# Altium schematic sheet DAC.SchDoc
size 193 x 146 mm; DocumentNumber: 1; SheetNumber: 1; SheetTotal: 11
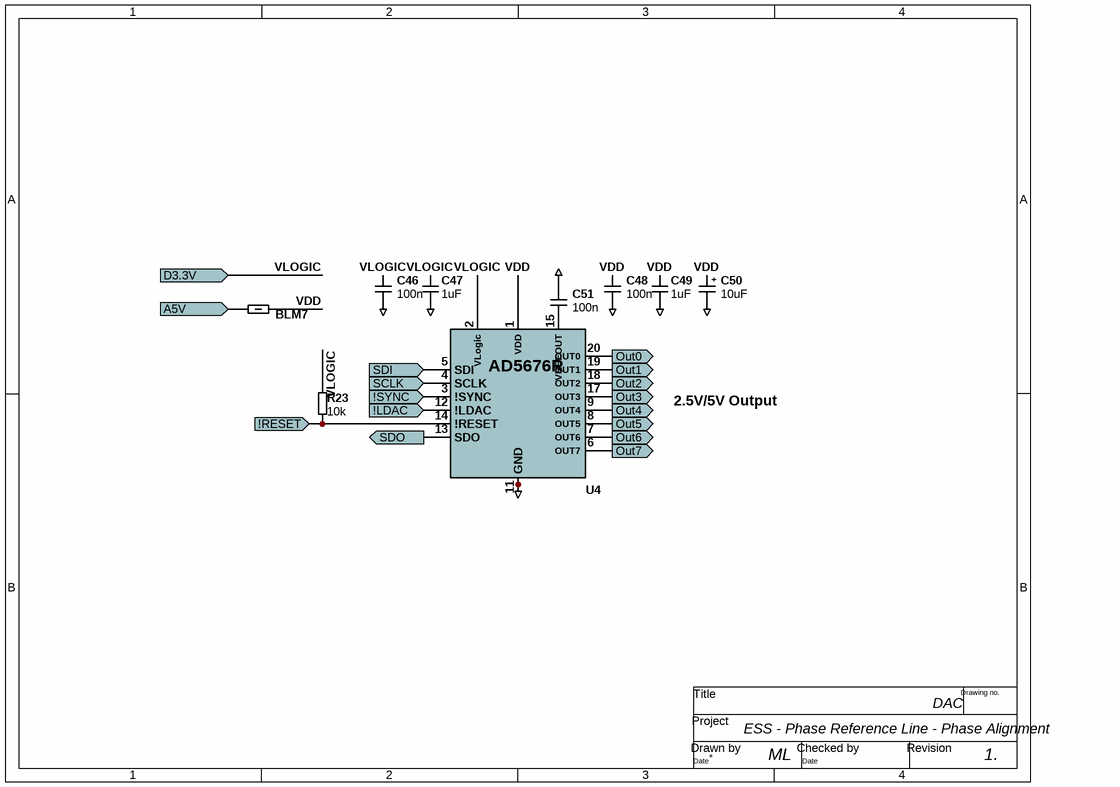
[diagram p0: DAC.SchDoc]

## Parts
BLM7  120 Ohms @ 100MHz  [0402-Inductor]  (value not drawn)
C46  100n  [0402-Capacitor]  (net tie, no BOM)
C47  1uF  [0805-Capacitor]
C48  100n  [0402-Capacitor]  (net tie, no BOM)
C49  1uF  [0805-Capacitor]
C50  10uF  [1206-cap_tant]
C51  100n  [0402-Capacitor]  (net tie, no BOM)
R23  10k  [0402-RESISTOR]
U4  AD5676R  [LFCSP-20]  (value not drawn)

## Ports
!LDAC (in), !RESET (in), !SYNC (in), A5V (in), D3.3V (in), Out0 (out), Out1 (out), Out2 (out), Out3 (out), Out4 (out), Out5 (out), Out6 (out), Out7 (out), SCLK (in), SDI (in), SDO (out)

## Nets
GND: C46.1 C47.2 C48.1 C49.2 C50.2(-) C51.2 U4.11(GND) U4.EP
!LDAC: U4.12(!LDAC) ; port !LDAC
!RESET: R23.2 U4.14(!RESET) ; port !RESET
!SYNC: U4.3(!SYNC) ; port !SYNC
A5V: BLM7.1 ; port A5V
Out0: U4.20(OUT0) ; port Out0
Out1: U4.19(OUT1) ; port Out1
Out2: U4.18(OUT2) ; port Out2
Out3: U4.17(OUT3) ; port Out3
Out4: U4.9(OUT4) ; port Out4
Out5: U4.8(OUT5) ; port Out5
Out6: U4.7(OUT6) ; port Out6
Out7: U4.6(OUT7) ; port Out7
SCLK: U4.4(SCLK) ; port SCLK
SDI: U4.5(SDI) ; port SDI
SDO: U4.13(SDO) ; port SDO
VDD: BLM7.2 C48.2 C49.1 C50.1(+) U4.1(VDD)
VLOGIC: C46.2 C47.1 R23.1 U4.2(VLogic) ; port D3.3V
NetC51_1: C51.1 U4.15(VREFOUT)

Not connected (* = marked no-connect by the designer): U4 10(NC) 16(NC)

## Notes on the sheet
- 2.5V/5V Output
- ESS - Phase Reference Line - Phase Alignment
- DAC
- ML
- 1.
- Title
- Project
- Drawing no.
- Date
- Drawn by
- Checked by
- Revision

## Library data of the parts
BLM7 = BLM15AX121SZ1D: 120 Ohms @ 100MHz 1 Power, Signal Line Ferrite Bead 0402 (1005 Metric) 700mA 130mOhm; Case: 0402; Supplier 1: Digi-Key; Supplier Part Number 1: 490-16510-1-ND; HelpURL: https://www.murata.com/en-us/products/productdata/8796748677150/QNFA9118.pdf
C46 C48 = C_0402: Capacitor 0402; Dielectric: X7R/C0G; Tolerance: ±20%; Voltage Rating: 16V; Value: 100n; Case: 0402
C47 C49 = C_0805: Capacitor 0805; Dielectric: X7R/C0G; Tolerance: ±20%; Voltage Rating: 16V; Value: 1uF; Case: 0805
C50 = C_10uF_Tant_16V_1206: CAP TANT 10UF 10% 16V 1206; Value: 10uF; Voltage Rating: 16V; Supplier 1: Digi-Key; Supplier Part Number 1: 399-8269-1-ND; Case: 1206
C51 = C_0402: Capacitor 0402; Tolerance: ±20%; Voltage Rating: 16V; Dielectric: X7R/C0G; Value: 100n; Case: 0402
R23 = R_0402: Resistor 0402; Tolerance: ±1%; Value: 10k; Case: 0402
U4 = AD5676R: Octal, 16-Bit nanoDAC+ with 2 ppm/°C Reference, SPI Interface /; HelpURL: https://www.analog.com/media/en/technical-documentation/data-sheets/ad5672r_5676r.pdf; Case: 20-WFQFN Exposed Pad, CSP; Supplier 1: Digi-Key; Supplier Part Number 1: AD5676RACPZ-REEL7CT-ND